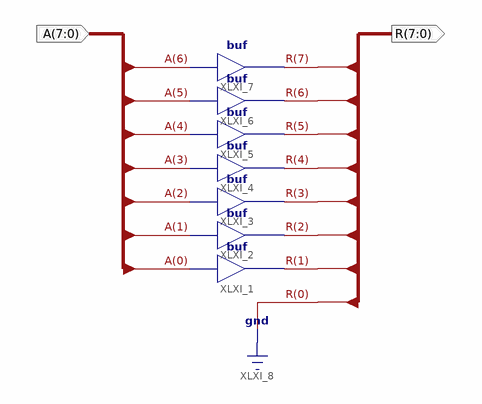
[diagram p0: schematic sheet 1]
// Xilinx ISE schematic ShiftLeft.sch (spartan6) as structural Verilog: 7 symbols, 2 ports
module ShiftLeft (
  input  [7:0] A,
  output [7:0] R
);

  buf XLXI_1 (R[1], A[0]);
  buf XLXI_2 (R[2], A[1]);
  buf XLXI_3 (R[3], A[2]);
  buf XLXI_4 (R[4], A[3]);
  buf XLXI_5 (R[5], A[4]);
  buf XLXI_6 (R[6], A[5]);
  buf XLXI_7 (R[7], A[6]);

  assign R[0] = 1'b0;
endmodule
